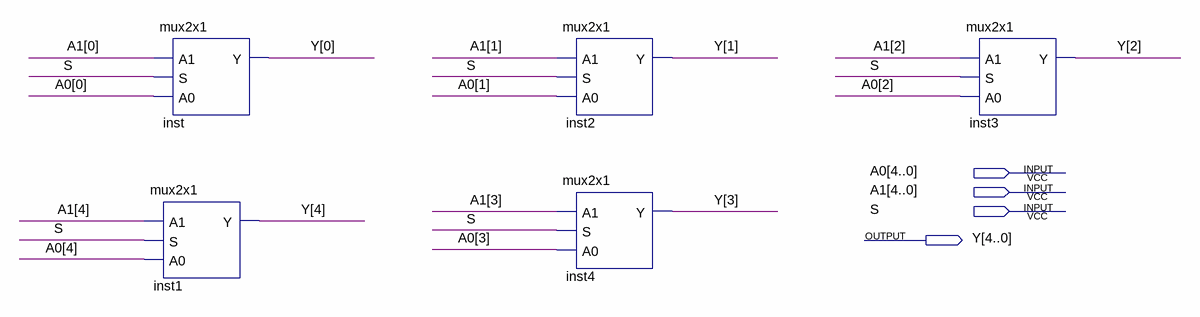
[diagram p0: schematic sheet]
// Quartus schematic mux2x5.bdf as structural Verilog: 5 symbols, 4 pins
module mux2x5 (
  input  [4:0] A0,
  input  [4:0] A1,
  input  S,
  output [4:0] Y
);

  mux2x1 inst1 (.A1(A1[4]), .S(S), .A0(A0[4]), .Y(Y[4]));
  mux2x1 inst (.A1(A1[0]), .S(S), .A0(A0[0]), .Y(Y[0]));
  mux2x1 inst2 (.A1(A1[1]), .S(S), .A0(A0[1]), .Y(Y[1]));
  mux2x1 inst4 (.A1(A1[3]), .S(S), .A0(A0[3]), .Y(Y[3]));
  mux2x1 inst3 (.A1(A1[2]), .S(S), .A0(A0[2]), .Y(Y[2]));
endmodule
